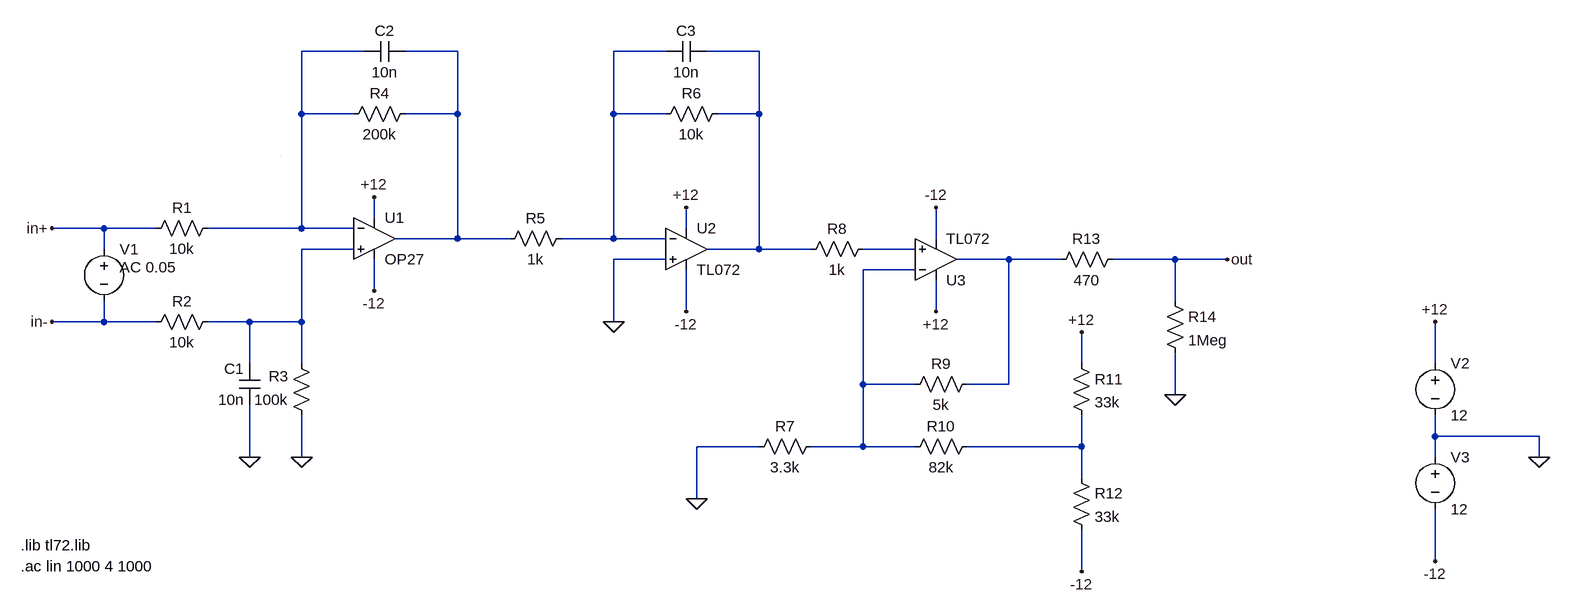
[diagram p0: schematic amp_green_island.asc]
amp_green_island.asc, the LTspice schematic file:
Version 4
SHEET 1 2840 744
WIRE 128 -160 32 -160
WIRE 272 -160 192 -160
WIRE 592 -160 512 -160
WIRE 736 -160 656 -160
WIRE 32 -64 32 -160
WIRE 112 -64 32 -64
WIRE 272 -64 272 -160
WIRE 272 -64 192 -64
WIRE 512 -64 512 -160
WIRE 592 -64 512 -64
WIRE 736 -64 736 -160
WIRE 736 -64 672 -64
WIRE 144 96 144 64
WIRE -272 112 -352 112
WIRE -192 112 -272 112
WIRE 32 112 32 -64
WIRE 32 112 -112 112
WIRE 112 112 32 112
WIRE 624 112 624 80
WIRE 272 128 272 -64
WIRE 272 128 176 128
WIRE 352 128 272 128
WIRE 512 128 512 -64
WIRE 512 128 432 128
WIRE 592 128 512 128
WIRE 1008 128 1008 80
WIRE -272 144 -272 112
WIRE 112 144 32 144
WIRE 736 144 736 -64
WIRE 736 144 656 144
WIRE 816 144 736 144
WIRE 976 144 896 144
WIRE 592 160 512 160
WIRE 1120 160 1040 160
WIRE 1200 160 1120 160
WIRE 1376 160 1280 160
WIRE 1456 160 1376 160
WIRE 976 176 896 176
WIRE 144 208 144 160
WIRE 1376 224 1376 160
WIRE 624 240 624 176
WIRE 1008 240 1008 192
WIRE -272 256 -272 224
WIRE -272 256 -352 256
WIRE -192 256 -272 256
WIRE -48 256 -112 256
WIRE 32 256 32 144
WIRE 32 256 -48 256
WIRE 512 256 512 160
WIRE -48 320 -48 256
WIRE 32 320 32 256
WIRE 1232 320 1232 272
WIRE 1776 320 1776 256
WIRE 896 352 896 176
WIRE 976 352 896 352
WIRE 1120 352 1120 160
WIRE 1120 352 1056 352
WIRE 1376 368 1376 304
WIRE 1776 432 1776 400
WIRE 1936 432 1776 432
WIRE 736 448 640 448
WIRE 896 448 896 352
WIRE 896 448 816 448
WIRE 976 448 896 448
WIRE 1232 448 1232 400
WIRE 1232 448 1056 448
WIRE -48 464 -48 384
WIRE 32 464 32 400
WIRE 1776 464 1776 432
WIRE 1936 464 1936 432
WIRE 1232 496 1232 448
WIRE 640 528 640 448
WIRE 1776 624 1776 544
WIRE 1232 640 1232 576
WIRE 0 0 0 0
FLAG -48 464 0
FLAG 32 464 0
FLAG 1936 464 0
FLAG 1776 256 +12
FLAG 1776 624 -12
FLAG 144 64 +12
FLAG 144 208 -12
FLAG -352 112 in+
FLAG -352 256 in-
FLAG 624 80 +12
FLAG 624 240 -12
FLAG 512 256 0
FLAG 640 528 0
FLAG 1232 272 +12
FLAG 1232 640 -12
FLAG 1456 160 out
FLAG 1376 368 0
FLAG 1008 80 -12
FLAG 1008 240 +12
SYMBOL OpAmps\\OP27 144 64 R0
SYMATTR InstName U1
SYMBOL res -96 96 R90
WINDOW 0 0 56 VBottom 2
WINDOW 3 32 56 VTop 2
SYMATTR InstName R1
SYMATTR Value 10k
SYMBOL res -96 240 R90
WINDOW 0 0 56 VBottom 2
WINDOW 3 32 56 VTop 2
SYMATTR InstName R2
SYMATTR Value 10k
SYMBOL res 48 416 R180
WINDOW 0 36 76 Left 2
WINDOW 3 36 40 Left 2
SYMATTR InstName R3
SYMATTR Value 100k
SYMBOL res 96 -48 R270
WINDOW 0 32 56 VTop 2
WINDOW 3 0 56 VBottom 2
SYMATTR InstName R4
SYMATTR Value 200k
SYMBOL res 336 144 R270
WINDOW 0 32 56 VTop 2
WINDOW 3 0 56 VBottom 2
SYMATTR InstName R5
SYMATTR Value 1k
SYMBOL cap -32 384 R180
WINDOW 0 24 56 Left 2
WINDOW 3 24 8 Left 2
SYMATTR InstName C1
SYMATTR Value 10n
SYMBOL cap 128 -144 R270
WINDOW 0 32 32 VTop 2
WINDOW 3 0 32 VBottom 2
SYMATTR InstName C2
SYMATTR Value 10n
SYMBOL voltage -272 128 R0
WINDOW 123 24 44 Left 2
WINDOW 39 0 0 Left 0
WINDOW 3 24 44 Left 2
SYMATTR Value2 AC 0.05
SYMATTR Value ""
SYMATTR InstName V1
SYMBOL voltage 1776 304 R0
WINDOW 123 0 0 Left 0
WINDOW 39 0 0 Left 0
SYMATTR InstName V2
SYMATTR Value 12
SYMBOL voltage 1776 448 R0
WINDOW 123 0 0 Left 0
WINDOW 39 0 0 Left 0
SYMATTR InstName V3
SYMATTR Value 12
SYMBOL OpAmps\\opamp2 624 80 R0
SYMATTR InstName U2
SYMATTR Value TL072
SYMBOL OpAmps\\opamp2 1008 224 M180
SYMATTR InstName U3
SYMATTR Value TL072
SYMBOL res 688 -80 R90
WINDOW 0 0 56 VBottom 2
WINDOW 3 32 56 VTop 2
SYMATTR InstName R6
SYMATTR Value 10k
SYMBOL cap 656 -176 R90
WINDOW 0 0 32 VBottom 2
WINDOW 3 32 32 VTop 2
SYMATTR InstName C3
SYMATTR Value 10n
SYMBOL res 832 432 R90
WINDOW 0 0 56 VBottom 2
WINDOW 3 32 56 VTop 2
SYMATTR InstName R7
SYMATTR Value 3.3k
SYMBOL res 912 128 R90
WINDOW 0 0 56 VBottom 2
WINDOW 3 32 56 VTop 2
SYMATTR InstName R8
SYMATTR Value 1k
SYMBOL res 1072 336 R90
WINDOW 0 0 56 VBottom 2
WINDOW 3 32 56 VTop 2
SYMATTR InstName R9
SYMATTR Value 5k
SYMBOL res 1072 432 R90
WINDOW 0 0 56 VBottom 2
WINDOW 3 32 56 VTop 2
SYMATTR InstName R10
SYMATTR Value 82k
SYMBOL res 1216 304 R0
SYMATTR InstName R11
SYMATTR Value 33k
SYMBOL res 1216 480 R0
SYMATTR InstName R12
SYMATTR Value 33k
SYMBOL res 1296 144 R90
WINDOW 0 0 56 VBottom 2
WINDOW 3 32 56 VTop 2
SYMATTR InstName R13
SYMATTR Value 470
SYMBOL res 1360 208 R0
SYMATTR InstName R14
SYMATTR Value 1Meg
TEXT -400 600 Left 2 !.lib tl72.lib
TEXT -400 632 Left 2 !.ac lin 1000 4 1000

The netlist it stands for:
* amp_green_island.asc
XU1 N005 N001 +12 -12 N002 OP27  ; pins In+ In- V+ V- OUT
R1 N001 in+ 10k
R2 N005 in- 10k
R3 0 N005 100k
R4 N001 N002 200k
R5 N002 N003 1k
C1 0 N005 10n
C2 N001 N002 10n
V1 in+ in- AC 0.05
V2 +12 0 12
V3 0 -12 12
XU2 0 N003 +12 -12 N004 TL072  ; pins In+ In- V+ V- OUT
XU3 N006 N008 +12 -12 N007 TL072  ; pins In+ In- V+ V- OUT
R6 N004 N003 10k
C3 N004 N003 10n
R7 N008 0 3.3k
R8 N006 N004 1k
R9 N007 N008 5k
R10 N009 N008 82k
R11 +12 N009 33k
R12 N009 -12 33k
R13 out N007 470
R14 out 0 1Meg
.lib tl72.lib
.ac lin 1000 4 1000
.lib ADI.lib
.backanno
.end